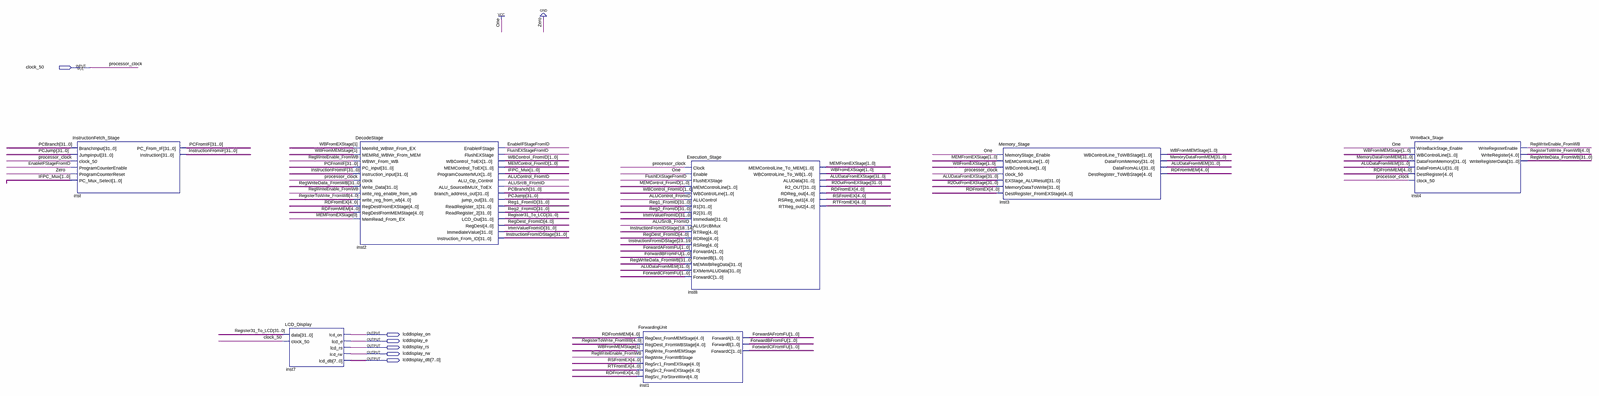
[diagram p0: schematic sheet, whole]
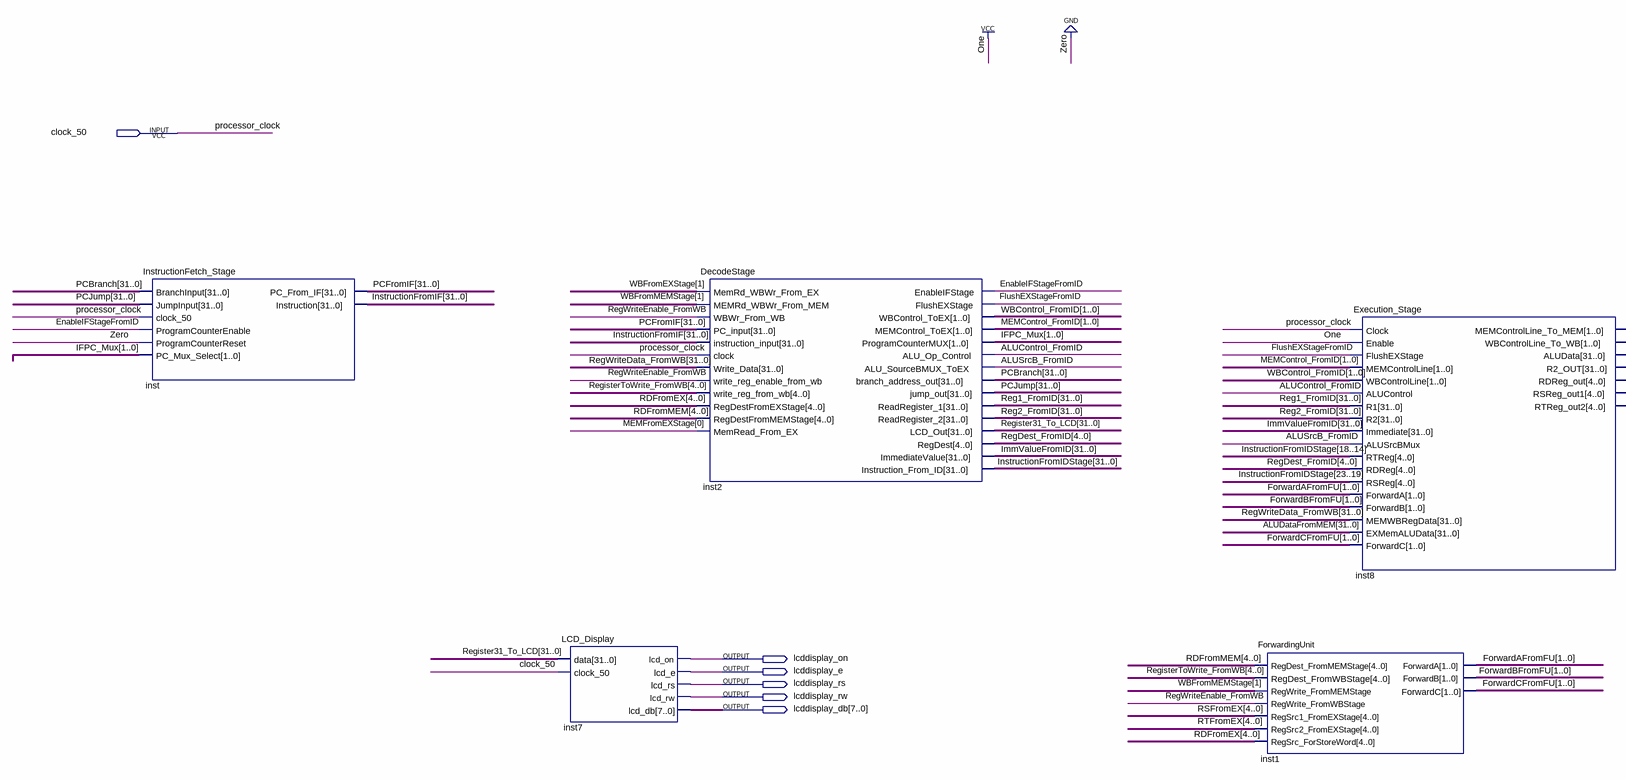
[diagram p1: schematic sheet, left part]
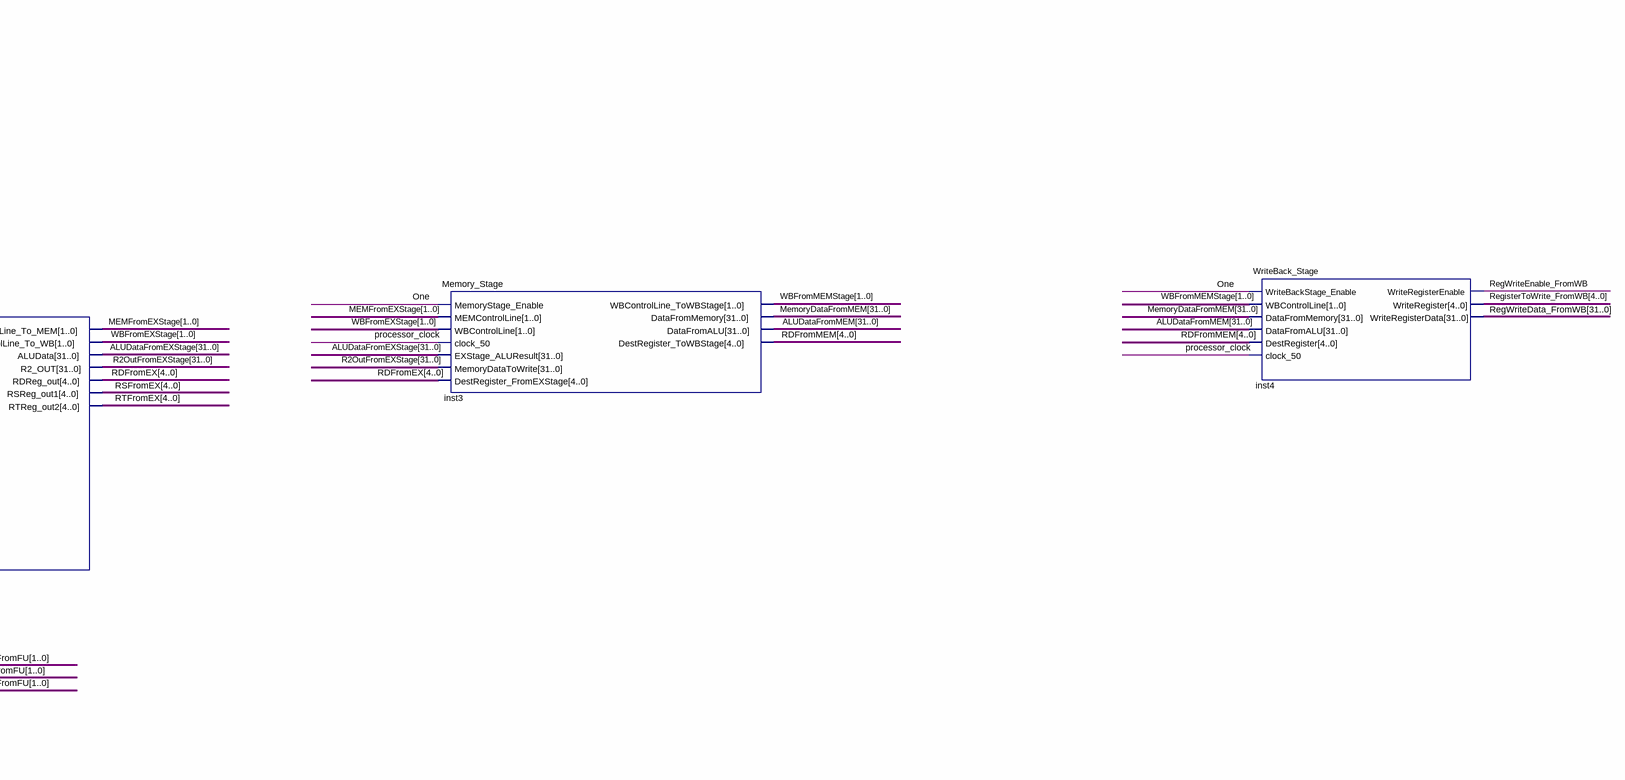
[diagram p2: schematic sheet, right part]
// Quartus schematic CacheMoney.bdf as structural Verilog: 7 symbols, 6 pins
module CacheMoney (
  input  clock_50,
  output lcddisplay_on,
  output lcddisplay_e,
  output lcddisplay_rs,
  output lcddisplay_rw,
  output [7:0] lcddisplay_db
);

  wire ALUControl_FromID, ALUSrcB_FromID, EnableIFStageFromID, FlushEXStageFromID, RegWriteEnable_FromWB;
  wire [1:0] ForwardAFromFU, ForwardBFromFU, ForwardCFromFU, IFPC_Mux, MEMControl_FromID, MEMFromEXStage,
       WBControl_FromID, WBFromEXStage, WBFromMEMStage;
  wire [4:0] RDFromEX, RDFromMEM, RegDest_FromID, RegisterToWrite_FromWB, RSFromEX, RTFromEX;
  wire [31:0] ALUDataFromEXStage, ALUDataFromMEM, ImmValueFromID, InstructionFromIDStage, InstructionFromIF,
       MemoryDataFromMEM, PCBranch, PCFromIF, PCJump, R2OutFromEXStage, Reg1_FromID, Reg2_FromID,
       Register31_To_LCD, RegWriteData_FromWB;

  InstructionFetch_Stage inst (
    .BranchInput(PCBranch), .JumpInput(PCJump), .clock_50(clock_50),
    .ProgramCounterEnable(EnableIFStageFromID), .ProgramCounterReset(1'b0), .PC_Mux_Select(IFPC_Mux),
    .PC_From_IF(PCFromIF), .Instruction(InstructionFromIF));
  LCD_Display inst7 (
    .data(Register31_To_LCD), .clock_50(clock_50), .lcd_on(lcddisplay_on), .lcd_e(lcddisplay_e),
    .lcd_rs(lcddisplay_rs), .lcd_rw(lcddisplay_rw), .lcd_db(lcddisplay_db));
  DecodeStage inst2 (
    .MemRd_WBWr_From_EX(WBFromEXStage[1]), .MEMRd_WBWr_From_MEM(WBFromMEMStage[1]),
    .WBWr_From_WB(RegWriteEnable_FromWB), .PC_input(PCFromIF), .instruction_input(InstructionFromIF),
    .clock(clock_50), .Write_Data(RegWriteData_FromWB), .write_reg_enable_from_wb(RegWriteEnable_FromWB),
    .write_reg_from_wb(RegisterToWrite_FromWB), .RegDestFromEXStage(RDFromEX),
    .RegDestFromMEMStage(RDFromMEM), .MemRead_From_EX(MEMFromEXStage[0]),
    .EnableIFStage(EnableIFStageFromID), .FlushEXStage(FlushEXStageFromID),
    .WBControl_ToEX(WBControl_FromID), .MEMControl_ToEX(MEMControl_FromID), .ProgramCounterMUX(IFPC_Mux),
    .ALU_Op_Control(ALUControl_FromID), .ALU_SourceBMUX_ToEX(ALUSrcB_FromID), .branch_address_out(PCBranch),
    .jump_out(PCJump), .ReadRegister_1(Reg1_FromID), .ReadRegister_2(Reg2_FromID),
    .LCD_Out(Register31_To_LCD), .RegDest(RegDest_FromID), .ImmediateValue(ImmValueFromID),
    .Instruction_From_ID(InstructionFromIDStage));
  ForwardingUnit inst1 (
    .RegDest_FromMEMStage(RDFromMEM), .RegDest_FromWBStage(RegisterToWrite_FromWB),
    .RegWrite_FromMEMStage(WBFromMEMStage[1]), .RegWrite_FromWBStage(RegWriteEnable_FromWB),
    .RegSrc1_FromEXStage(RSFromEX), .RegSrc2_FromEXStage(RTFromEX), .RegSrc_ForStoreWord(RDFromEX),
    .ForwardA(ForwardAFromFU), .ForwardB(ForwardBFromFU), .ForwardC(ForwardCFromFU));
  Execution_Stage inst8 (
    .Clock(clock_50), .Enable(1'b1), .FlushEXStage(FlushEXStageFromID), .MEMControlLine(MEMControl_FromID),
    .WBControlLine(WBControl_FromID), .ALUControl(ALUControl_FromID), .R1(Reg1_FromID), .R2(Reg2_FromID),
    .Immediate(ImmValueFromID), .ALUSrcBMux(ALUSrcB_FromID), .RTReg(InstructionFromIDStage[18:14]),
    .RDReg(RegDest_FromID), .RSReg(InstructionFromIDStage[23:19]), .ForwardA(ForwardAFromFU),
    .ForwardB(ForwardBFromFU), .MEMWBRegData(RegWriteData_FromWB), .EXMemALUData(ALUDataFromMEM),
    .ForwardC(ForwardCFromFU), .MEMControlLine_To_MEM(MEMFromEXStage), .WBControlLine_To_WB(WBFromEXStage),
    .ALUData(ALUDataFromEXStage), .R2_OUT(R2OutFromEXStage), .RDReg_out(RDFromEX), .RSReg_out1(RSFromEX),
    .RTReg_out2(RTFromEX));
  Memory_Stage inst3 (
    .MemoryStage_Enable(1'b1), .MEMControlLine(MEMFromEXStage), .WBControlLine(WBFromEXStage),
    .clock_50(clock_50), .EXStage_ALUResult(ALUDataFromEXStage), .MemoryDataToWrite(R2OutFromEXStage),
    .DestRegister_FromEXStage(RDFromEX), .WBControlLine_ToWBStage(WBFromMEMStage),
    .DataFromMemory(MemoryDataFromMEM), .DataFromALU(ALUDataFromMEM), .DestRegister_ToWBStage(RDFromMEM));
  WriteBack_Stage inst4 (
    .WriteBackStage_Enable(1'b1), .WBControlLine(WBFromMEMStage), .DataFromMemory(MemoryDataFromMEM),
    .DataFromALU(ALUDataFromMEM), .DestRegister(RDFromMEM), .clock_50(clock_50),
    .WriteRegisterEnable(RegWriteEnable_FromWB), .WriteRegister(RegisterToWrite_FromWB),
    .WriteRegisterData(RegWriteData_FromWB));

  // Other names for the same wires on the sheet: processor_clock = clock_50
endmodule
